# Altium schematic sheet rf_detector_detector.SchDoc: SPE Router
size 420 x 297 mm; Author: P. Daniel; CompanyName: WUT ISE; DrawnBy: P. Daniel; Organization: WUT ISE; Address1: WUT ISE; Address2: Nowowiejska 15/19 00-665 Warsaw; Address3: piotrmaciejdaniel@gmail.com; Revision: 1; SheetNumber: 5; SheetTotal: 6; ModifiedBy: -; CreateDate: 02-03.2023; CheckedDate: -; Title2: PoE power supply; DivGrp: WUT ISE; Designer: Piotr Daniel
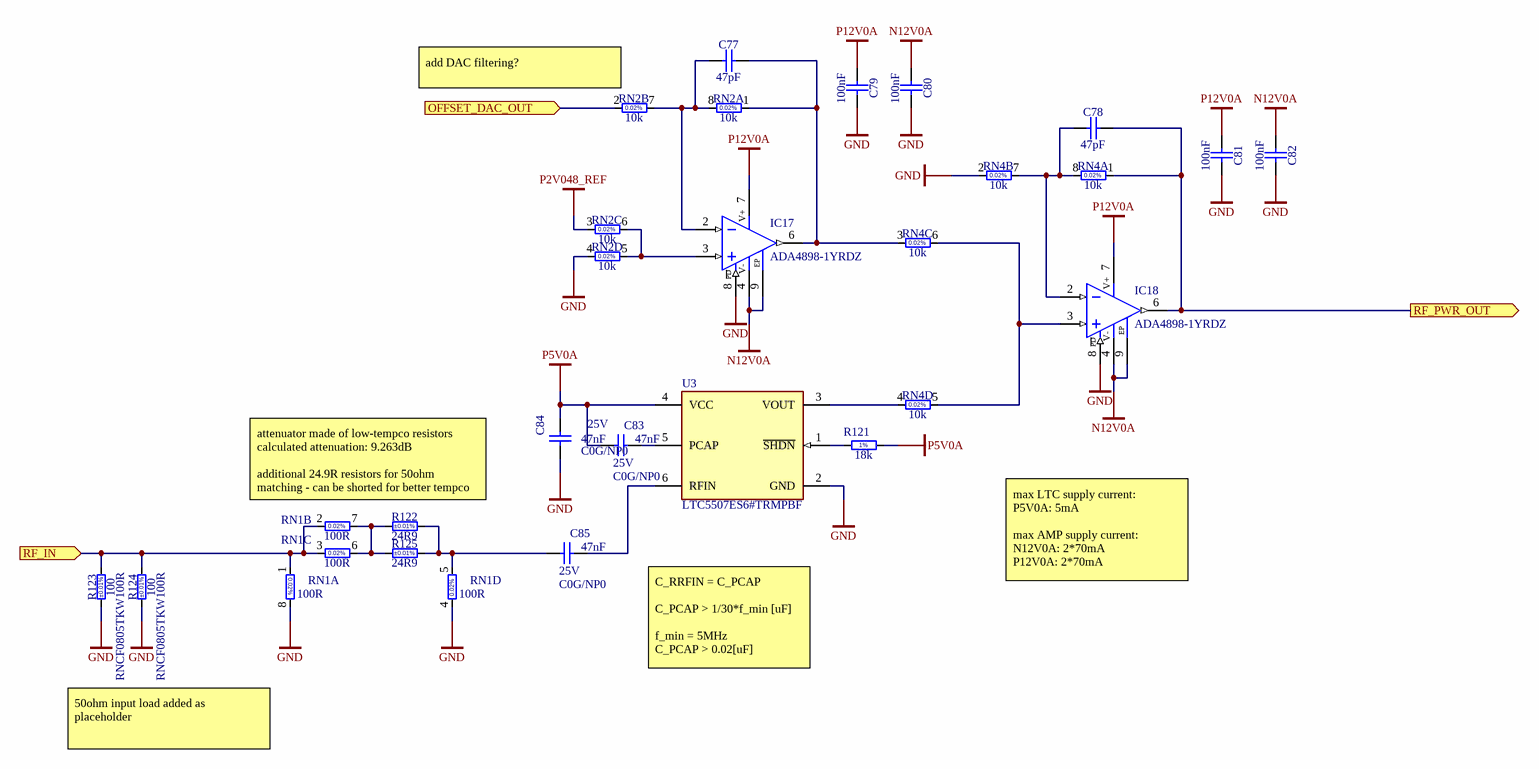
[diagram p0: rf_detector_detector.SchDoc]

## Parts
C77  47pF  [CAPC3216X94N]
C78  47pF  [CAPC3216X94N]
C79  100nF  [CAPC1005X55N]
C80  100nF  [CAPC1005X55N]
C81  100nF  [CAPC1005X55N]
C82  100nF  [CAPC1005X55N]
C83  47nF  Voltage: 25V  TC: C0G/NP0  [CAPC2012X135N]
C84  47nF  Voltage: 25V  TC: C0G/NP0  [CAPC2012X135N]
C85  47nF  Voltage: 25V  TC: C0G/NP0  [CAPC2012X135N]
IC17  ADA4898-1YRDZ  [SOIC127P600X175-9N-S229]
IC18  ADA4898-1YRDZ  [SOIC127P600X175-9N-S229]
R121  18k  [RESC1005X40N]
R122  24R9  Tolerance: ±0.01%  [RESC2012X60N]
R123  100  Tolerance: ±0.01%  Part Number: RNCF0805TKW100R  [RESC2012X60N]
R124  100  Tolerance: ±0.01%  Part Number: RNCF0805TKW100R  [RESC2012X60N]
R125  24R9  Tolerance: ±0.01%  [RESC2012X60N]
RN1  100R  [SOIC127P600X175-8N]  (parts A,B,C,D of 4)
RN2  10k  [SOIC127P600X175-8N]  (parts A,B,C,D of 4)
RN4  10k  [SOIC127P600X175-8N]  (parts A,B,C,D of 4)
U3  LTC5507ES6#TRMPBF  [FP-LTC5507ES6#TRMPBF-MFG]

## Ports
OFFSET_DAC_OUT (in), RF_IN (in), RF_PWR_OUT (out)

## Nets
GND: C79.1 C80.1 C81.1 C82.1 C84.1 IC17.8(~{DS}) IC18.8(~{DS}) R123.1 R124.1 RN1.4 RN1.8 RN2.4 RN4.2 U3.2(GND)
N12V0A: C80.2 C82.2 IC17.4(V-) IC17.9(EP) IC18.4(V-) IC18.9(EP)
P2V048_REF: RN2.3
P5V0A: C83.1 C84.2 R121.2 U3.4(VCC)
P12V0A: C79.2 C81.2 IC17.7(V+) IC18.7(V+)
OFFSET_DAC_OUT: RN2.2 ; port OFFSET_DAC_OUT
RF_IN: R123.2 R124.2 RN1.1 RN1.2 RN1.3 ; port RF_IN
RF_PWR_OUT: C78.2 IC18.6(OUT) RN4.1 ; port RF_PWR_OUT
NetC77_1: C77.1 IC17.2(IN-) RN2.7 RN2.8
NetC77_2: C77.2 IC17.6(OUT) RN2.1 RN4.3
NetC78_1: C78.1 IC18.2(IN-) RN4.7 RN4.8
NetC83_2: C83.2 U3.5(PCAP)
NetC85_1: C85.1 R122.2 R125.2 RN1.5
NetC85_2: C85.2 U3.6(RFIN)
NetIC17_3: IC17.3(IN+) RN2.5 RN2.6
NetIC18_3: IC18.3(IN+) RN4.5 RN4.6
NetR121_1: R121.1 U3.1(~{SHDN})
NetR122_1: R122.1 R125.1 RN1.6 RN1.7
NetRN4_4: RN4.4 U3.3(VOUT)

## Notes on the sheet
- (near RN2) add DAC filtering?
- attenuator made of low-tempco resistors
  calculated attenuation: 9.263dB
  additional 24.9R resistors for 50ohm matching - can be shorted for better tempco
- max LTC supply current:
  P5V0A: 5mA
  max AMP supply current:
  N12V0A: 2*70mA
  P12V0A: 2*70mA
- C_RRFIN = C_PCAP
  C_PCAP > 1/30*f_min [uF]
  f_min = 5MHz
  C_PCAP > 0.02[uF]
- 50ohm input load added as placeholder
- Project/Equipment
- Document
- Designer
- Drawn by
- Check.by
- Copyright WUT ISE 2021.
  This documentation describes Open Hardware and is licensed under the CERN OHL v.1.1. You may redistribute and modify this documentation under the terms of the CERN OHL v.1.1. (http://ohwr.org/CERNOHL). This documentation is distributed WITHOUT ANY EXPRESS OR IMPLIED WARRANTY, INCLUDING OF MERCHANTABILITY, SATISFACTORY QUALITY AND FITNESS FOR A PARTICULAR PURPOSE. Please see the CERN OHL v.1.1 for applicable conditions.
- Contact
- File
- Last Mod.
- Print Date
- Sheet
- Size
- A3
- of
- Rev
- (in symbol ADA4898-1YRDZ) PD
- (in symbol R0402_18K_1%_0.0625W_100PPM) 1%

## Library data of the parts
C77 C78 = CC1206_47PF_100V_5%_C0G: Non-polarised capacitor; Part Description: SMD Multilayer Chip Ceramic Capacitor; Manufacturer: GENERIC; Manufacturer1 Part Number: 12061A470JAT2A; Voltage: 100V; TC: C0G/NP0; Tolerance: ±5%; Part Number: CC1206_47PF_100V_5%_C0G; Component Kind: Standard; Component Type: Standard; Pin Count: 2; Value: 47pF; Status: Preferred; Manufacturer Part Number: CC1206_47PF_100V_5%_C0G; Case: 1206; Mounted: Yes; Socket: No; SMD: Yes; Sense: No; Manufacturer1 Example: AVX; Manufacturer1 ComponentHeight: 0.94mm; HelpURL: \\cern.ch\dfs\Applications\Altium\Datasheets\CC1206_C0G_AVX.pdf; Author: CERN DEM JLC; CreateDate: 06.11.2014; LatestRevisionDate: 06.11.2014
C79-C82 = CC0402_100NF_16V_10%_X7R: Non-polarised capacitor; Part Description: SMD Multilayer Chip Ceramic Capacitor; Manufacturer: GENERIC; Manufacturer1 Part Number: GRM155R71C104KA88D; Voltage: 16V; TC: X7R; Tolerance: ±10%; Part Number: CC0402_100NF_16V_10%_X7R; Component Kind: Standard; Component Type: Standard; Pin Count: 2; Value: 100nF; Status: Not Recommended; Manufacturer Part Number: CC0402_100NF_16V_10%_X7R; Case: 0402; Mounted: Yes; Socket: No; SMD: Yes; Sense: No; Manufacturer1 Example: MURATA; Manufacturer1 ComponentHeight: 0.55mm; HelpURL: \\cern.ch\dfs\Applications\Altium\Datasheets\CC0402_X7R_MURATA_GRM.pdf; Author: CERN DEM JLC; CreateDate: 05.12.2013; LatestRevisionDate: 03.12.2007
C83-C85 = CC0805_47NF_25V_5%_C0G: Non-polarised capacitor; Part Description: SMD Multilayer Chip Ceramic Capacitor; Manufacturer: GENERIC; Manufacturer1 Part Number: C0805C473J3GACTU; Tolerance: ±5%; Part Number: CC0805_47NF_25V_5%_C0G; Component Kind: Standard; Component Type: Standard; Pin Count: 2; Value: 47nF; Status: None; Manufacturer Part Number: CC0805_47NF_25V_5%_C0G; Case: 0805; Mounted: Yes; Socket: No; SMD: Yes; Sense: No; Manufacturer1 Example: KEMET; Manufacturer1 ComponentHeight: 1.4mm; HelpURL: \\cern.ch\dfs\Applications\Altium\Datasheets\CC0805_C0G_KEMET_(Commercial Grade).pdf; Author: CERN DEM JLC; CreateDate: 18/01/2011; LatestRevisionDate: 18/01/2011
IC17 IC18 = ADA4898-1YRDZ: High Voltage, Low Noise, Low Distortion, Unity-Gain Stable, High Speed Operational Amplifier; Part Description: Single, High Voltage, Low Noise, Low Distortion, Unity-Gain Stable, High Speed Operational Amplifier; Manufacturer: ANALOG DEVICES; PressFit: No; Bonding: No; Part Number: ADA4898-1YRDZ; Component Kind: Standard; Component Type: Standard; Device: ADA4898-1YRDZ; PackageDescription: SOIC, 1.27mm Pitch; 8 Pin, 3.90mm W X 4.90mm L X 1.75mm H body (w/Thermal Tab 2.29 X 2.29mm), IPC Medium Density; Manufacturer Part Number: ADA4898-1YRD; Pin Count: 9; Case: SOIC8; Mounted: Yes; Socket: No; SMD: Yes; Sense: No; ComponentHeight: 1.75mm; Author: CERN DEM JLC; HelpURL: \\cern.ch\dfs\Applications\Altium\Datasheets\ADA4898-1YRDZ.pdf; CreateDate: 14.04.2014; LatestRevisionDate: 31.03.2022
R121 = R0402_18K_1%_0.0625W_100PPM: Resistor - 1%; Part Description: General Purpose Thick Film Chip Resistor; Manufacturer: GENERIC; Manufacturer1 Part Number: 232270671803L; TC: ±100ppm/°C; PressFit: No; Part Number: R0402_18K_1%_0.0625W_100PPM; Component Kind: Standard; Component Type: Standard; Pin Count: 2; Value: 18k; Status: Not Recommended; Power: 0.0625W; Tolerance: ±1%; Manufacturer Part Number: R0402_18K_1%_0.0625W_100PPM; Case: 0402; Mounted: Yes; Sense: No; Socket: No; SMD: Yes; Manufacturer1 Example: YAGEO PHYCOMP; Manufacturer1 ComponentHeight: 0.4mm; HelpURL: \\cern.ch\dfs\Applications\Altium\Datasheets\R0402_Phycomp_RC0402.pdf; Author: CERN DEM JLC; CreateDate: 03.12.2007; LatestRevisionDate: 17.10.2012
R122 R125 = R0805_24R9_0.1%_0.1W_10PPM: Resistor - 0.01%; Part Number: R0805_24R9_0.01%_0.1W_2PPM; Part Description: Thin Film Chip Resistor; Manufacturer: GENERIC; Manufacturer1 Part Number: RU73X2A24R9LTDF; Power: 0.1W; TC: ±2pm; PressFit: No; Component Kind: Standard; Component Type: Standard; Pin Count: 2; Value: 24R9; Status: Not Recommended; Manufacturer Part Number: R0805_24R9_0.01%_0.1W_2PPM; Case: 0805; Mounted: Yes; Sense: No; Socket: No; SMD: Yes; Manufacturer1 Example: TYCO HOLSWORTHY; Manufacturer1 ComponentHeight: 0.6mm; HelpURL: \\cern.ch\dfs\Applications\Altium\Datasheets\R0805_Tyco_RN73.pdf; Author: CERN DEM JLC; CreateDate: 03.12.2007; LatestRevisionDate: 13.03.2008
R123 R124 = R0805_100R_0.1%_0.1W_10PPM: Resistor - 0.01% / 2PPM; Part Description: Thin Film Chip Resistor; Manufacturer: GENERIC; Manufacturer1 Part Number: RN73C2A100RBTG; Power: 0.1W; TC: ±10ppm; PressFit: No; Component Kind: Standard; Component Type: Standard; Pin Count: 2; Value: 100; Status: Not Recommended; Manufacturer Part Number: R0805_100R_0.1%_0.1W_10PPM; Case: 0805; Mounted: Yes; Sense: No; Socket: No; SMD: Yes; Manufacturer1 Example: TYCO HOLSWORTHY; Manufacturer1 ComponentHeight: 0.6mm; HelpURL: \\cern.ch\dfs\Applications\Altium\Datasheets\R0805_Tyco_RN73.pdf; Author: CERN DEM JLC; CreateDate: 03.12.2007; LatestRevisionDate: 13.03.2008
RN1 = RN_1K_1K_VISHAY_Y1747V0191QT9: DIL8 Resistor Network 4 Isolated Resistor 0.01%; Part Number: RN_100R_100R_VISHAY_Y1747V0178; Part Description: Ultra High Precision Z-Foil Surface Mount 4 Resistors Network, SMNZ Series; Manufacturer: VISHAY FOIL RESISTOR; Manufacturer Part Number: Y1747V0178; Power: 4x0.1W; TC: ±0.2ppm/°C; Tolerance: 0.02%; PressFit: No; Component Kind: Standard; Component Type: Standard; Pin Count: 8; Value: 100R; Sense: No; Case: SOIC8; Mounted: Yes; Socket: No; SMD: Yes; ComponentHeight: 1.86mm; HelpURL: \\cern.ch\dfs\Applications\Altium\Datasheets\RN_VISHAY_SMNZ.pdf; Author: CERN DEM JMW; CreateDate: 11.06.2019; LatestRevisionDate: 11.06.2019
RN2 RN4 = RN_10K_10K_VISHAY_Y1747V0008QT9: DIL8 Resistor Network 4 Isolated Resistor 0.01%; Part Description: Ultra High Precision Z-Foil Surface Mount 4 Resistors Network, SMNZ Series; Manufacturer: VISHAY FOIL RESISTOR; Power: 4x0.1W; TC: ±0.2ppm/°C; Tolerance: 0.02%; PressFit: No; Part Number: RN_10K_10K_VISHAY_Y1747V0008QT9; Component Kind: Standard; Component Type: Standard; Pin Count: 8; Value: 10k; Sense: No; Manufacturer Part Number: Y1747V0008QT9; Case: SOIC8; Mounted: Yes; Socket: No; SMD: Yes; ComponentHeight: 1.86mm; HelpURL: \\cern.ch\dfs\Applications\Altium\Datasheets\RN_VISHAY_SMNZ.pdf; Author: CERN DEM BC; CreateDate: 02.09.2019; LatestRevisionDate: 02.09.2019
U3 = CMP-09141-000004-1: IC RF DETECT 100KHZ-1GHZ TSOT23; Manufacturer: Analog Devices; Standoff Height: 0.01mm; Max Junction Temp: +125°C; Max Frequency: 1000MHz; Bandwidth: 999.9MHz; Temperature Range Low: -40°C; ComponentLink2URL: https://www.analog.com/media/en/technical-documentation/data-sheets/5507f.pdf; Automotive: No; Device Class L2: RF Semiconductors and Devices; Height: 1mm; RoHS: TRUE; Mouser Description: RF Detector 0.1MHz to 1000MHz 14dBm Automotive 6-Pin TSOT-23 T/R; Lead Free: Yes; Temperature Range High: +85°C; Device Class L3: unset; Category: IC; Octopart: https://octopart.com/ltc5507es6%23trmpbf-analog+devices-88320008; Digikey Description: IC RF DETECT 100KHZ-1GHZ TSOT23; Package: TSOT-23; Temperature: -40°C to +85°C; ComponentLink2Description: Datasheet; Device Class L1: Integrated Circuits (ICs); Manufacturer Part Number: LTC5507ES6#TRMPBF; Ipc Land Pattern Name: SOT95P280X91-6